# Altium project mom-s.PrjPcb (part 2 of 2)

## Sheet intf_conn_pwr.SchDoc
size OrCAD B; DocumentNumber: 3; SheetNumber: 3; SheetTotal: 3
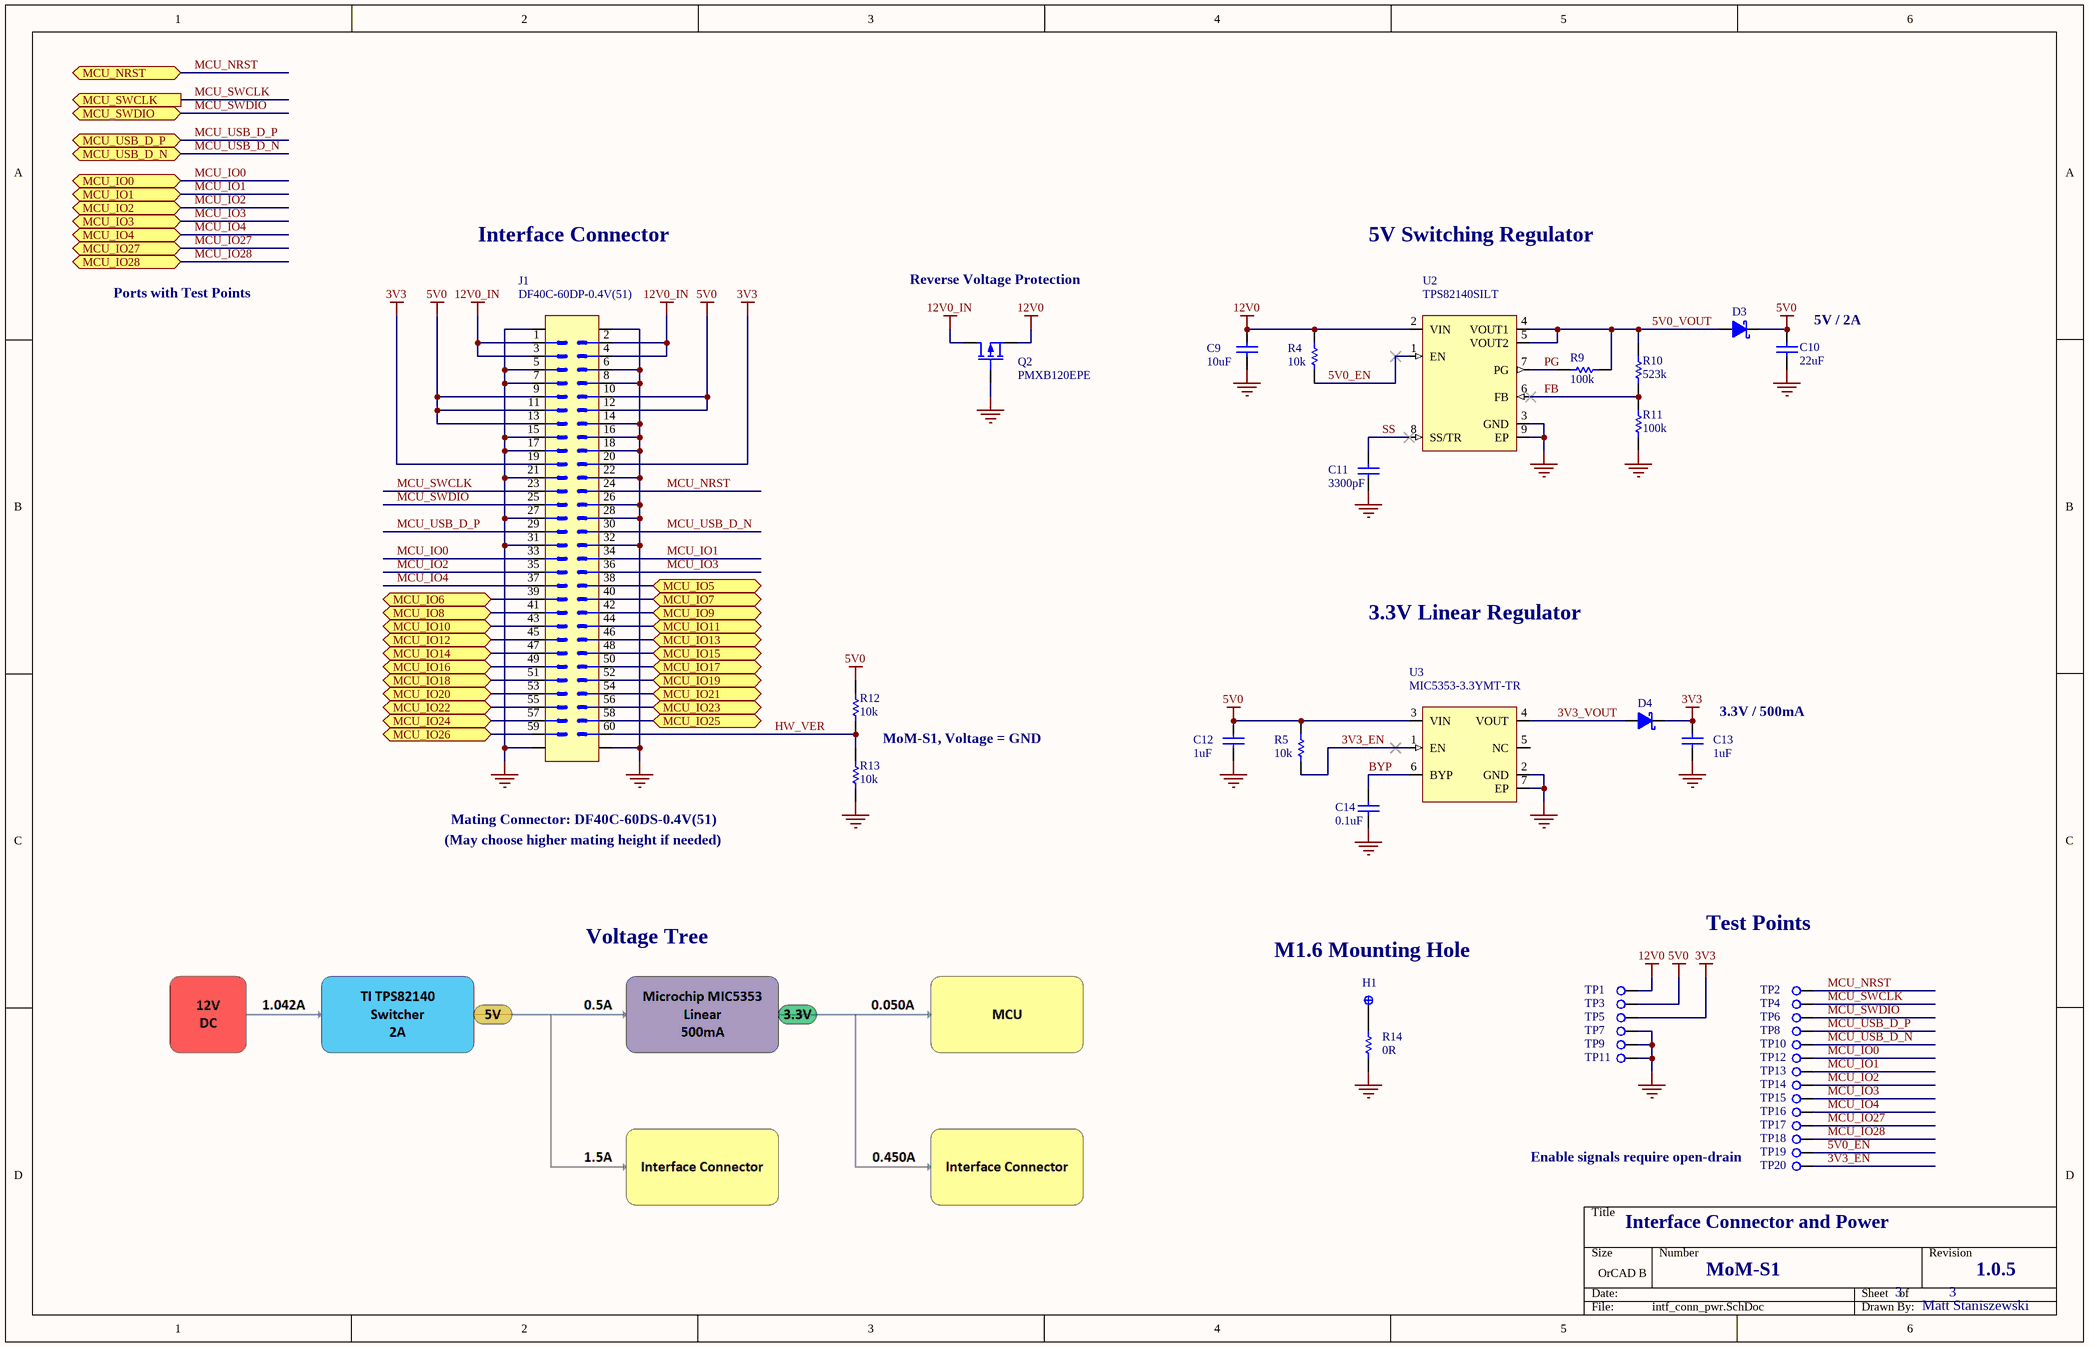
[diagram p2: intf_conn_pwr.SchDoc]

### Parts
C9  10uF  [C0603]
C10  22uF  [C0603]
C11  3300pF  [C0201]
C12  1uF  [C0402]
C13  1uF  [C0402]
C14  0.1uF  [C0201]
D3  SDM2U30CSP-7  [DIO_X3-WLB1608-2]  (value not drawn)
D4  SDM2U30CSP-7  [DIO_X3-WLB1608-2]  (value not drawn)
H1  M1.6 MNT HOLE  [MNT_HOLE_M1.6]  (value not drawn)
J1  DF40C-60DP-0.4V(51)  [HRS_DF40C_60P_PLG]
Q2  PMXB120EPE  [NXP_DFN1010D-3]
R4  10k  [R0201]
R5  10k  [R0201]
R9  100k  [R0201]
R10  523k  [R0201]
R11  100k  [R0201]
R12  10k  [R0201]
R13  10k  [R0201]
R14  0R  [R0201]
TP1  TP SMT 0.5MM  [TP_SMT_0.5MM]  (value not drawn)
TP2  TP SMT 0.5MM  [TP_SMT_0.5MM]  (value not drawn)
TP3  TP SMT 0.5MM  [TP_SMT_0.5MM]  (value not drawn)
TP4  TP SMT 0.5MM  [TP_SMT_0.5MM]  (value not drawn)
TP5  TP SMT 0.5MM  [TP_SMT_0.5MM]  (value not drawn)
TP6  TP SMT 0.5MM  [TP_SMT_0.5MM]  (value not drawn)
TP7  TP SMT 0.5MM  [TP_SMT_0.5MM]  (value not drawn)
TP8  TP SMT 0.5MM  [TP_SMT_0.5MM]  (value not drawn)
TP9  TP SMT 0.5MM  [TP_SMT_0.5MM]  (value not drawn)
TP10  TP SMT 0.5MM  [TP_SMT_0.5MM]  (value not drawn)
TP11  TP SMT 0.5MM  [TP_SMT_0.5MM]  (value not drawn)
TP12  TP SMT 0.5MM  [TP_SMT_0.5MM]  (value not drawn)
TP13  TP SMT 0.5MM  [TP_SMT_0.5MM]  (value not drawn)
TP14  TP SMT 0.5MM  [TP_SMT_0.5MM]  (value not drawn)
TP15  TP SMT 0.5MM  [TP_SMT_0.5MM]  (value not drawn)
TP16  TP SMT 0.5MM  [TP_SMT_0.5MM]  (value not drawn)
TP17  TP SMT 0.5MM  [TP_SMT_0.5MM]  (value not drawn)
TP18  TP SMT 0.5MM  [TP_SMT_0.5MM]  (value not drawn)
TP19  TP SMT 0.5MM  [TP_SMT_0.5MM]  (value not drawn)
TP20  TP SMT 0.5MM  [TP_SMT_0.5MM]  (value not drawn)
U2  TPS82140SILT  [TI_USIL8_SIL0008D]
U3  MIC5353-3.3YMT-TR  [MCP_MLF6_MT]

### Ports
MCU_IO0 (bidir), MCU_IO1 (bidir), MCU_IO2 (bidir), MCU_IO3 (bidir), MCU_IO4 (bidir), MCU_IO5 (bidir), MCU_IO6 (bidir), MCU_IO7 (bidir), MCU_IO8 (bidir), MCU_IO9 (bidir), MCU_IO10 (bidir), MCU_IO11 (bidir), MCU_IO12 (bidir), MCU_IO13 (bidir), MCU_IO14 (bidir), MCU_IO15 (bidir), MCU_IO16 (bidir), MCU_IO17 (bidir), MCU_IO18 (bidir), MCU_IO19 (bidir), MCU_IO20 (bidir), MCU_IO21 (bidir), MCU_IO22 (bidir), MCU_IO23 (bidir), MCU_IO24 (bidir), MCU_IO25 (bidir), MCU_IO26 (bidir), MCU_IO27 (bidir), MCU_IO28 (bidir), MCU_NRST (bidir), MCU_SWCLK (out), MCU_SWDIO (bidir), MCU_USB_D_N (bidir), MCU_USB_D_P (bidir)

### Nets
3V3: C13.2 D4.1(K) J1.19 J1.20 TP5.1
5V0: C10.2 C12.2 D3.1(K) J1.9 J1.10 J1.11 J1.12 J1.13 R5.2 R12.2 TP3.1 U3.3(VIN)
12V0: C9.2 Q2.2(S) R4.2 TP1.1 U2.2(VIN)
12V0_IN: J1.1 J1.2 J1.3 J1.4 Q2.3(D)
GND: C9.1 C10.1 C11.1 C12.1 C13.1 C14.1 J1.5 J1.6 J1.7 J1.8 J1.14 J1.15 J1.16 J1.17 J1.18 J1.21 J1.22 J1.26 J1.27 J1.28 J1.31 J1.32 J1.61 J1.62 J1.63 J1.64 Q2.1(G) R11.1 R13.1 R14.1 TP7.1 TP9.1 TP11.1 U2.3(GND) U2.9(EP) U3.2(GND) U3.7(EP)
3V3_EN: R5.1 TP20.1 U3.1(EN)
3V3_VOUT: D4.2(A) U3.4(VOUT)
5V0_EN: R4.1 TP19.1 U2.1(EN)
5V0_VOUT: D3.2(A) R9.2 R10.2 U2.4(VOUT1) U2.5(VOUT2)
BYP: C14.2 U3.6(BYP)
FB: R10.1 R11.2 U2.6(FB)
HW_VER: J1.60 R12.1 R13.2
MCU_IO0: J1.33 TP12.1 ; port MCU_IO0
MCU_IO1: J1.34 TP13.1 ; port MCU_IO1
MCU_IO2: J1.35 TP14.1 ; port MCU_IO2
MCU_IO3: J1.36 TP15.1 ; port MCU_IO3
MCU_IO4: J1.37 TP16.1 ; port MCU_IO4
MCU_IO5: J1.38 ; port MCU_IO5
MCU_IO6: J1.39 ; port MCU_IO6
MCU_IO7: J1.40 ; port MCU_IO7
MCU_IO8: J1.41 ; port MCU_IO8
MCU_IO9: J1.42 ; port MCU_IO9
MCU_IO10: J1.43 ; port MCU_IO10
MCU_IO11: J1.44 ; port MCU_IO11
MCU_IO12: J1.45 ; port MCU_IO12
MCU_IO13: J1.46 ; port MCU_IO13
MCU_IO14: J1.47 ; port MCU_IO14
MCU_IO15: J1.48 ; port MCU_IO15
MCU_IO16: J1.49 ; port MCU_IO16
MCU_IO17: J1.50 ; port MCU_IO17
MCU_IO18: J1.51 ; port MCU_IO18
MCU_IO19: J1.52 ; port MCU_IO19
MCU_IO20: J1.53 ; port MCU_IO20
MCU_IO21: J1.54 ; port MCU_IO21
MCU_IO22: J1.55 ; port MCU_IO22
MCU_IO23: J1.56 ; port MCU_IO23
MCU_IO24: J1.57 ; port MCU_IO24
MCU_IO25: J1.58 ; port MCU_IO25
MCU_IO26: J1.59 ; port MCU_IO26
MCU_IO27: TP17.1 ; port MCU_IO27
MCU_IO28: TP18.1 ; port MCU_IO28
MCU_NRST: J1.24 TP2.1 ; port MCU_NRST
MCU_SWCLK: J1.23 TP4.1 ; port MCU_SWCLK
MCU_SWDIO: J1.25 TP6.1 ; port MCU_SWDIO
MCU_USB_D_N: J1.30 TP10.1 ; port MCU_USB_D_N
MCU_USB_D_P: J1.29 TP8.1 ; port MCU_USB_D_P
PG: R9.1 U2.7(PG)
SS: C11.2 U2.8(SS/TR)
NetH1_1: H1.1 R14.2

Not connected (* = marked no-connect by the designer): U3 5(NC)

### Notes on the sheet
- Interface Connector
- Reverse Voltage Protection
- 5V Switching Regulator
- Ports with Test Points
- (near C10) 5V / 2A
- 3.3V Linear Regulator
- MoM-S1, Voltage = GND
- (near C13) 3.3V / 500mA
- Mating Connector: DF40C-60DS-0.4V(51)
- (May choose higher mating height if needed)
- Voltage Tree
- (near H1) M1.6 Mounting Hole
- Test Points
- Enable signals require open-drain
- Interface Connector and Power

### Library data of the parts
C9 = 10uF 25V 0603: CAP CER 10UF 25V X5R 0603; Manufacturer: Murata; Manufacturer Part Number: GRM188R61E106MA73D; Tolerance: 20%; Supplier 1: Digi-Key; Stock 1: 1088965; Pricing 1: 1=0.41, 10=0.285, 100=0.1708, 500=0.1281, 1000=0.1082 (USD); Mount: Surface Mount; Case/Package: 0603; Number of Pins: 2; Weight: 0.000222oz; Case Code (Metric): 1608; Case Code (Imperial): 0603; Min Operating Temperature: -55°C; Max Operating Temperature: 85°C; Voltage Rating: 25V; Capacitance: 10uF; Packaging: Tape and Reel; Package Quantity: 1; Dielectric: X5R; Voltage: 25V; Termination: SMD/SMT; Composition: Ceramic; Voltage Rating (DC): 25V; Length: 1.6mm; Height: 0.8mm; Width: 0.031inch; Thickness: 0.031inch; Depth: 0.8mm; REACH SVHC: No SVHC; Lead Free: Lead Free; ComponentLink1URL: https://datasheet.ciiva.com/22619/c02e-22619674.pdf; ComponentLink1Description: https://datasheet.ciiva.com/22619/c02e-22619674.pdf; ComponentLink2URL: https://datasheet.ciiva.com/22776/608985-22776426.pdf; ComponentLink2Description: https://datasheet.ciiva.com/22776/608985-22776426.pdf; ComponentLink3URL: https://datasheet.ciiva.com/22776/c02e-22776427.pdf; ComponentLink3Description: https://datasheet.ciiva.com/22776/c02e-22776427.pdf; ComponentLink4URL: https://datasheet.ciiva.com/14906/partnumbering-e-01-14906429.pdf; ComponentLink4Description: https://datasheet.ciiva.com/14906/partnumbering-e-01-14906429.pdf; ComponentLink5URL: https://datasheet.ciiva.com/14906/partnumbering-e-01-14906431.pdf; ComponentLink5Description: https://datasheet.ciiva.com/14906/partnumbering-e-01-14906431.pdf; Supplier Part Number 1: 490-7202-1-ND
C10 = 22uF 16V 0603: CAP CER 22UF 16V X5R 0603; Manufacturer: Samsung; Manufacturer Part Number: CL10A226MO7JZNC; Supplier 1: Digi-Key; Stock 1: 0; Supplier Part Number 1: 1276-7076-1-ND
C11 = 3300pF 16V 0201: CAP CER 3300PF 16V X7R 0201; Manufacturer: Murata; Manufacturer Part Number: GRM033R71C332KA88D; Material: Ceramic; Capacitance: 3.3nF; Tolerance: 10%; Supplier 1: Digi-Key; Stock 1: 49387; Pricing 1: 1=0.1, 10=0.029, 100=0.013, 500=0.0093, 1000=0.0073, 2500=0.0067, 5000=0.0061 (USD); Mount: Surface Mount; Case/Package: 0201; Case Code (Metric): 0603; Case Code (Imperial): 0201; Min Operating Temperature: -55°C; Max Operating Temperature: 125°C; Packaging: Tape and Reel; Package Quantity: 1; Voltage Rating: 16V; Voltage Rating (DC): 16V; Dielectric: X7R; Termination: SMD/SMT; Length: 0.6mm; Height: 0.3mm; Width: 0.012inch; Thickness: 0.013inch; Depth: 0.3mm; Radiation Hardening: No; Lead Free: Lead Free; ComponentLink1URL: https://datasheet.ciiva.com/11620/product-11620449.pdf; ComponentLink1Description: https://datasheet.ciiva.com/11620/product-11620449.pdf; ComponentLink2URL: https://datasheet.ciiva.com/129/grm033r71c332ka88-01-129900.pdf; ComponentLink2Description: https://datasheet.ciiva.com/129/grm033r71c332ka88-01-129900.pdf; ComponentLink3URL: https://datasheet.ciiva.com/129/grm033r71c332ka88-01-129901.pdf; ComponentLink3Description: https://datasheet.ciiva.com/129/grm033r71c332ka88-01-129901.pdf; ComponentLink4URL: https://datasheet.ciiva.com/18184/getdatasheetpartid-467171-18184093.pdf; ComponentLink4Description: https://datasheet.ciiva.com/18184/getdatasheetpartid-467171-18184093.pdf; ComponentLink5URL: https://datasheet.ciiva.com/129/grm033r71c332ka88-01-129902.pdf; ComponentLink5Description: https://datasheet.ciiva.com/129/grm033r71c332ka88-01-129902.pdf; ComponentLink6URL: https://datasheet.ciiva.com/29199/455779-da-01-en-vs-kondensator-0201-29199166.pdf; ComponentLink6Description: https://datasheet.ciiva.com/29199/455779-da-01-en-vs-kondensator-0201-29199166.pdf; Supplier Part Number 1: 490-3191-1-ND
C12 C13 = 1uF 25V 0402: CAP CER 1UF 25V X5R 0402; Manufacturer: Taiyo Yuden; Manufacturer Part Number: TMK105BJ105MV-F; Tolerance: 20%; Supplier 1: Digi-Key; Stock 1: 113342; Pricing 1: 1=0.2, 10=0.14, 100=0.066, 500=0.0463, 1000=0.0383, 2500=0.0357, 5000=0.0326 (USD); Mount: Surface Mount; Case/Package: 0402; Case Code (Metric): 1005; Case Code (Imperial): 0402; Min Operating Temperature: -55°C; Max Operating Temperature: 85°C; Packaging: Tape and Reel; Package Quantity: 1; Voltage Rating (DC): 25V; Dielectric: X5R; Termination: SMD/SMT; Capacitance: 1uF; Voltage Rating: 25V; Composition: Ceramic; Length: 1mm; Height: 0.5mm; Width: 0.02inch; Thickness: 0.022inch; Depth: 0.5mm; Radiation Hardening: No; Halogen Free: Halogen Free; ComponentLink1URL: https://datasheet.ciiva.com/11596/tmk105bj105mv-f-ss-11596466.pdf; ComponentLink1Description: https://datasheet.ciiva.com/11596/tmk105bj105mv-f-ss-11596466.pdf; ComponentLink2URL: https://datasheet.ciiva.com/15922/tmk105bj105mv-f-pdf-15922317.pdf; ComponentLink2Description: https://datasheet.ciiva.com/15922/tmk105bj105mv-f-pdf-15922317.pdf; ComponentLink3URL: https://datasheet.ciiva.com/13404/mlcc-all-e-541559-13404206.pdf; ComponentLink3Description: https://datasheet.ciiva.com/13404/mlcc-all-e-541559-13404206.pdf; ComponentLink4URL: https://datasheet.ciiva.com/30154/128tmk105bj105mv-f-30154639.pdf; ComponentLink4Description: https://datasheet.ciiva.com/30154/128tmk105bj105mv-f-30154639.pdf; Supplier Part Number 1: 587-3245-1-ND
C14 = 0.1uF 16V 0201: CAP CER 0.1UF 16V X5R 0201; Manufacturer: Murata; Manufacturer Part Number: GRM033R61C104ME84D; Capacitance: 1E-07f; Tolerance: 20%; Supplier 1: Digi-Key; Stock 1: 660567; Pricing 1: 1=0.1, 10=0.029, 100=0.013, 500=0.0093, 1000=0.0073, 2500=0.0067, 5000=0.0061 (USD); Case/Package: 0201; Weight: 1.2E-05oz; Case Code (Metric): 0603; Case Code (Imperial): 0201; Min Operating Temperature: -55°C; Max Operating Temperature: 85°C; Packaging: Tape and Reel; Voltage Rating: 16V; Dielectric: X5R; Termination: SMD/SMT; Voltage Rating (DC): 16V; Package Quantity: 15000; Length: 0.024inch; Height: 0.3mm; Width: 0.3mm; Thickness: 0.013inch; ComponentLink1URL: http://www.mouser.com/ds/2/281/c02e-2905.pdf; ComponentLink1Description: http://www.mouser.com/ds/2/281/c02e-2905.pdf; Supplier Part Number 1: 490-9986-1-ND
D3 D4 = SDM2U30CSP-7: DIODE SCHTKY 30V 2A X3-WLB1608-2; Manufacturer: Diodes; Capacitance: 1.1E-10f; Reverse Voltage (DC): 20V; Element Configuration: Single; Forward Voltage: 480mV; Max Forward Surge Current (Ifsm): 20A; Peak Reverse Current: 150uA; Supplier 1: Digi-Key; Manufacturer Part Number: SDM2U30CSP-7; Stock 1: 13123; Pricing 1: 1=0.39, 10=0.32, 100=0.2175, 500=0.16316, 1000=0.12236 (USD); Mount: Surface Mount; Number of Pins: 2; Min Operating Temperature: -55°C; Max Operating Temperature: 150°C; Packaging: Tape and Reel; Average Rectified Current: 2A; Forward Current: 2A; Max Repetitive Reverse Voltage (Vrrm): 20V; Package Quantity: 5000; Max Reverse Voltage (DC): 30V; Supplier Part Number 1: SDM2U30CSP-7DICT-ND
H1 = M1.6 MNT HOLE: M1.6 Mounting Hole
J1 = 60P 0.4mm Hirose Conn Plug: CONN HDR 60POS 0.4MM SMD GOLD; Manufacturer: Hirose; Connector Type: Plug; Number of Contacts: 60; Voltage Rating: 30V; Current Rating: 300mA; Gender: Male; Stack Height: 3.5mm; Supplier 1: Digi-Key; Manufacturer Part Number: DF40C-60DP-0.4V(51); Stock 1: 18849; Pricing 1: 1=1.24, 10=1.094, 25=1.0296, 50=0.9868, 100=0.9438, 250=0.858, 500=0.7722, 1000=0.6864, 2500=0.6221 (USD); Mount: Surface Mount; Case/Package: SMD/SMT; Contact Material: Bronze; Contact Plating: Gold; Housing Material: Polymer; Termination: SMD/SMT; Package Quantity: 5000; Number of Rows: 2; Packaging: Tape and Reel; Number of Positions: 60; Pitch: 0.4mm; REACH SVHC: No SVHC; Lead Free: Lead Free; ComponentLink1URL: https://datasheet.ciiva.com/46408/1824826-46408908.pdf; ComponentLink1Description: https://datasheet.ciiva.com/46408/1824826-46408908.pdf; Supplier Part Number 1: H11628CT-ND
Q2 = PMXB120EPE: MOSFET P-CH 30V 2.4A 3DFN; Manufacturer: NXP Semiconductors; Rds On Max: 120mR; Input Capacitance: 309pF; Max Power Dissipation: 400mW; Resistance: 0.1R; Threshold Voltage: -1.5V; Supplier 1: Digi-Key; Manufacturer Part Number: PMXB120EPE; Stock 1: 23; Pricing 1: 1=0.5, 10=0.393, 100=0.2695, 500=0.18478, 1000=0.13859 (USD); Mount: Surface Mount; Number of Pins: 3; Min Operating Temperature: -55°C; Max Operating Temperature: 150°C; Packaging: Tape and Reel; Drain to Source Voltage (Vdss): 30V; Continuous Drain Current (ID): 2.4A; Package Quantity: 5000; REACH SVHC: No SVHC; ComponentLink1URL: https://datasheet.ciiva.com/29748/pmxb120epe-29748512.pdf; ComponentLink1Description: https://datasheet.ciiva.com/29748/pmxb120epe-29748512.pdf; ComponentLink2URL: https://datasheet.ciiva.com/29748/pmxb120epe-29748520.pdf; ComponentLink2Description: https://datasheet.ciiva.com/29748/pmxb120epe-29748520.pdf; Supplier Part Number 1: 1727-1472-1-ND
R4 R5 R12 R13 = 10k 0201: RES SMD 10K OHM 1% 1/20W 0201; Manufacturer: Panasonic ECG; Manufacturer Part Number: ERJ-1GEF1002C; Resistance: 10KR; Power Rating: 50mW; Voltage Rating: 25V; Temperature Coefficient: 200ppm/°C; Voltage Rating (DC): 15V; Supplier 1: Digi-Key; Stock 1: 4709989; Pricing 1: 1=0.1, 10=0.059, 100=0.024, 1000=0.0108, 2500=0.0094, 5000=0.0077 (USD); Mount: Surface Mount; Case/Package: 0201; Case Code (Metric): 0603; Case Code (Imperial): 0201; Contact Plating: Tin; Min Operating Temperature: -55°C; Max Operating Temperature: 125°C; Tolerance: 1%; Packaging: Tape and Reel; Package Quantity: 15000; Composition: Thick Film; Number of Terminations: 2; Termination: SMD/SMT; Military Standard: Not; Max Power Dissipation: 50mW; Length: 0.6mm; Height: 0.23mm; Width: 0.012inch; Depth: 0.3mm; Radiation Hardening: No; REACH SVHC: Unknown; Lead Free: Lead Free; ComponentLink1URL: https://datasheet.ciiva.com/16427/erj-1gef1002c-16427252.pdf; ComponentLink1Description: https://datasheet.ciiva.com/16427/erj-1gef1002c-16427252.pdf; ComponentLink2URL: https://datasheet.ciiva.com/30111/aoa0000ce2-30111653.pdf; ComponentLink2Description: https://datasheet.ciiva.com/30111/aoa0000ce2-30111653.pdf; ComponentLink3URL: https://datasheet.ciiva.com/16775/70260683-16775527.pdf; ComponentLink3Description: https://datasheet.ciiva.com/16775/70260683-16775527.pdf; ComponentLink4URL: https://datasheet.ciiva.com/22785/1678796-22785991.pdf; ComponentLink4Description: https://datasheet.ciiva.com/22785/1678796-22785991.pdf; ComponentLink5URL: https://datasheet.ciiva.com/7830/1678796-7830952.pdf; ComponentLink5Description: https://datasheet.ciiva.com/7830/1678796-7830952.pdf; ComponentLink6URL: https://datasheet.ciiva.com/16770/70260683-16770095.pdf; ComponentLink6Description: https://datasheet.ciiva.com/16770/70260683-16770095.pdf; Supplier Part Number 1: P10.0KABCT-ND
R9 R11 = 100k 0201: RES SMD 100K OHM 1% 1/20W 0201; Manufacturer: Panasonic ECG; Manufacturer Part Number: ERJ-1GEF1003C; Resistance: 100KR; Power Rating: 50mW; Voltage Rating: 25V; Temperature Coefficient: 200ppm/°C; Voltage Rating (DC): 15V; Supplier 1: Digi-Key; Stock 1: 4025669; Pricing 1: 1=0.1, 10=0.059, 100=0.024, 1000=0.0108, 2500=0.0094, 5000=0.0077 (USD); Mount: Surface Mount; Case/Package: 0201; Case Code (Metric): 0603; Case Code (Imperial): 0201; Contact Plating: Tin; Min Operating Temperature: -55°C; Max Operating Temperature: 125°C; Tolerance: 1%; Packaging: Tape and Reel; Package Quantity: 1; Composition: Thick Film; Number of Terminations: 2; Termination: SMD/SMT; Military Standard: Not; Max Power Dissipation: 50mW; Length: 0.6mm; Height: 0.01inch; Width: 0.012inch; Depth: 0.3mm; Radiation Hardening: No; REACH SVHC: Unknown; Lead Free: Lead Free; ComponentLink1URL: https://datasheet.ciiva.com/2439/erj-g-r-e-rev08-2439265.pdf; ComponentLink1Description: https://datasheet.ciiva.com/2439/erj-g-r-e-rev08-2439265.pdf; ComponentLink2URL: https://datasheet.ciiva.com/2439/erj-g-r-e-rev08-2439266.pdf; ComponentLink2Description: https://datasheet.ciiva.com/2439/erj-g-r-e-rev08-2439266.pdf; ComponentLink3URL: https://datasheet.ciiva.com/2439/erj-g-r-e-rev08-2439267.pdf; ComponentLink3Description: https://datasheet.ciiva.com/2439/erj-g-r-e-rev08-2439267.pdf; ComponentLink4URL: https://datasheet.ciiva.com/7830/1678796-7830953.pdf; ComponentLink4Description: https://datasheet.ciiva.com/7830/1678796-7830953.pdf; ComponentLink5URL: https://datasheet.ciiva.com/16205/erj-1gef1003c-16205689.pdf; ComponentLink5Description: https://datasheet.ciiva.com/16205/erj-1gef1003c-16205689.pdf; ComponentLink6URL: https://datasheet.ciiva.com/16782/70260683-16782969.pdf; ComponentLink6Description: https://datasheet.ciiva.com/16782/70260683-16782969.pdf; ComponentLink7URL: https://datasheet.ciiva.com/28514/1694929-28514010.pdf; ComponentLink7Description: https://datasheet.ciiva.com/28514/1694929-28514010.pdf; ComponentLink8URL: https://datasheet.ciiva.com/30087/aoa0000ce2-30087131.pdf; ComponentLink8Description: https://datasheet.ciiva.com/30087/aoa0000ce2-30087131.pdf; Supplier Part Number 1: P100KABCT-ND
R10 = 523k 0201: RES SMD 523K OHM 1% 1/20W 0201; Manufacturer: Panasonic ECG; Manufacturer Part Number: ERJ-1GEF5233C; Resistance: 523KR; Power Rating: 50mW; Voltage Rating: 25V; Temperature Coefficient: 200ppm/°C; Voltage Rating (DC): 15V; Supplier 1: Digi-Key; Stock 1: 42844; Pricing 1: 1=0.1, 10=0.059, 100=0.024, 1000=0.0108, 2500=0.0094, 5000=0.0077 (USD); Mount: Surface Mount; Case/Package: 0201; Case Code (Metric): 0603; Case Code (Imperial): 0201; Contact Plating: Tin; Min Operating Temperature: -55°C; Max Operating Temperature: 125°C; Tolerance: 1%; Packaging: Tape and Reel; Package Quantity: 1; Composition: Thick Film; Number of Terminations: 2; Max Power Dissipation: 50mW; Length: 0.024inch; Height: 0.01inch; Width: 0.012inch; Lead Free: Lead Free; ComponentLink1URL: https://datasheet.ciiva.com/2440/erj-g-r-e-rev08-2440225.pdf; ComponentLink1Description: https://datasheet.ciiva.com/2440/erj-g-r-e-rev08-2440225.pdf; ComponentLink2URL: https://datasheet.ciiva.com/2440/erj-g-r-e-rev08-2440226.pdf; ComponentLink2Description: https://datasheet.ciiva.com/2440/erj-g-r-e-rev08-2440226.pdf; ComponentLink3URL: https://datasheet.ciiva.com/2440/erj-g-r-e-rev08-2440227.pdf; ComponentLink3Description: https://datasheet.ciiva.com/2440/erj-g-r-e-rev08-2440227.pdf; Supplier Part Number 1: P523KABCT-ND
R14 = 0R 0201: RES SMD 0 OHM JUMPER 1/20W 0201; Manufacturer: Panasonic; Manufacturer Part Number: ERJ-1GN0R00C; Resistance: 0mR; Power Rating: 50mW; Tolerance: 1%; Voltage Rating: 25V; Temperature Coefficient: 600ppm/°C; Supplier 1: Digi-Key; Stock 1: 7705948; Pricing 1: 1=0.1, 10=0.028, 25=0.0204, 50=0.0154, 100=0.0114, 250=0.00872, 500=0.00696, 1000=0.00513, 5000=0.00368 (USD); Mount: Surface Mount; Case/Package: 0201; Case Code (Imperial): 0201; Case Code (Metric): 0603; Contact Plating: Tin; Min Operating Temperature: -55°C; Max Operating Temperature: 125°C; Packaging: Tape and Reel; Package Quantity: 15000; Composition: Thick Film; Military Standard: Not; Voltage Rating (DC): 25V; Length: 0.6mm; Height: 0.23mm; Width: 0.3mm; Depth: 0.3mm; REACH SVHC: Unknown; Lead Free: Lead Free; ComponentLink1URL: https://datasheet.ciiva.com/22730/1678796-22730749.pdf; ComponentLink1Description: https://datasheet.ciiva.com/22730/1678796-22730749.pdf; Supplier Part Number 1: P15979CT-ND
TP1-TP20 = TP SMT 0.5MM: 0.5mm SMT Test Point
U2 = TPS82140SILT: STEP-DOWN CONVERTER MICROSIP; Manufacturer: Texas Instruments; Supplier 1: Digi-Key; Manufacturer Part Number: TPS82140SILT; Stock 1: 0; Min Operating Temperature: -40°C; Max Operating Temperature: 125°C; Supplier Part Number 1: 296-47089-1-ND
U3 = MIC5353-3.3YMT-TR: IC REG LINEAR 3.3V 500MA 6TMLF; Manufacturer: Microchip; Dropout Voltage: 160mV; Number of Regulators: 1; Min Current Limit: 600mA; Min Input Voltage: 2.6V; Max Input Voltage: 6V; Supplier 1: Digi-Key; Manufacturer Part Number: MIC5353-3.3YMT-TR; Stock 1: 24501; Pricing 1: 1=0.36, 25=0.294, 100=0.273 (USD); Number of Pins: 6; Min Operating Temperature: -40°C; Max Operating Temperature: 125°C; Packaging: Cut Tape; Output Voltage: 3.3V; Output Current: 500mA; Nominal Output Voltage: 3.3V; REACH SVHC: No SVHC; Lead Free: Lead Free; ComponentLink1URL: http://www.farnell.com/datasheets/1692673.pdf; ComponentLink1Description: http://www.farnell.com/datasheets/1692673.pdf; Supplier Part Number 1: 576-3680-1-ND

## Nets that join several sheets
3V3: mcu (12 pins), intf_conn_pwr (5 pins)
5V0: mcu (D1.2 D2.2), intf_conn_pwr (12 pins)
GND: mcu (16 pins), intf_conn_pwr (37 pins)
MCU_IO0: mcu (U1.10), intf_conn_pwr (J1.33 TP12.1)
MCU_IO1: mcu (U1.11), intf_conn_pwr (J1.34 TP13.1)
MCU_IO2: mcu (U1.12), intf_conn_pwr (J1.35 TP14.1)
MCU_IO3: mcu (U1.13), intf_conn_pwr (J1.36 TP15.1)
MCU_IO4: mcu (U1.14), intf_conn_pwr (J1.37 TP16.1)
MCU_IO5: mcu (U1.15), intf_conn_pwr (J1.38)
MCU_IO6: mcu (U1.16), intf_conn_pwr (J1.39)
MCU_IO7: mcu (U1.17), intf_conn_pwr (J1.40)
MCU_IO8: mcu (U1.29), intf_conn_pwr (J1.41)
MCU_IO9: mcu (U1.30), intf_conn_pwr (J1.42)
MCU_IO10: mcu (U1.31), intf_conn_pwr (J1.43)
MCU_IO11: mcu (U1.38), intf_conn_pwr (J1.44)
MCU_IO12: mcu (U1.18), intf_conn_pwr (J1.45)
MCU_IO13: mcu (U1.19), intf_conn_pwr (J1.46)
MCU_IO14: mcu (U1.20), intf_conn_pwr (J1.47)
MCU_IO15: mcu (U1.39), intf_conn_pwr (J1.48)
MCU_IO16: mcu (U1.40), intf_conn_pwr (J1.49)
MCU_IO17: mcu (U1.41), intf_conn_pwr (J1.50)
MCU_IO18: mcu (U1.42), intf_conn_pwr (J1.51)
MCU_IO19: mcu (U1.43), intf_conn_pwr (J1.52)
MCU_IO20: mcu (U1.45), intf_conn_pwr (J1.53)
MCU_IO21: mcu (U1.46), intf_conn_pwr (J1.54)
MCU_IO22: mcu (U1.21), intf_conn_pwr (J1.55)
MCU_IO23: mcu (U1.22), intf_conn_pwr (J1.56)
MCU_IO24: mcu (U1.25), intf_conn_pwr (J1.57)
MCU_IO25: mcu (U1.26), intf_conn_pwr (J1.58)
MCU_IO26: mcu (U1.27), intf_conn_pwr (J1.59)
MCU_IO27: mcu (U1.3), intf_conn_pwr (TP17.1)
MCU_IO28: mcu (U1.4), intf_conn_pwr (TP18.1)
MCU_NRST: mcu (C1.2 R7.1 U1.7), intf_conn_pwr (J1.24 TP2.1)
MCU_SWCLK: mcu (U1.37), intf_conn_pwr (J1.23 TP4.1)
MCU_SWDIO: mcu (U1.34), intf_conn_pwr (J1.25 TP6.1)
MCU_USB_D_N: mcu (U1.32), intf_conn_pwr (J1.30 TP10.1)
MCU_USB_D_P: mcu (U1.33), intf_conn_pwr (J1.29 TP8.1)

## Assembly variants
Default: not fitted R6 R12